# EAGLE design cap meter bubble (EAGLE 6.1)
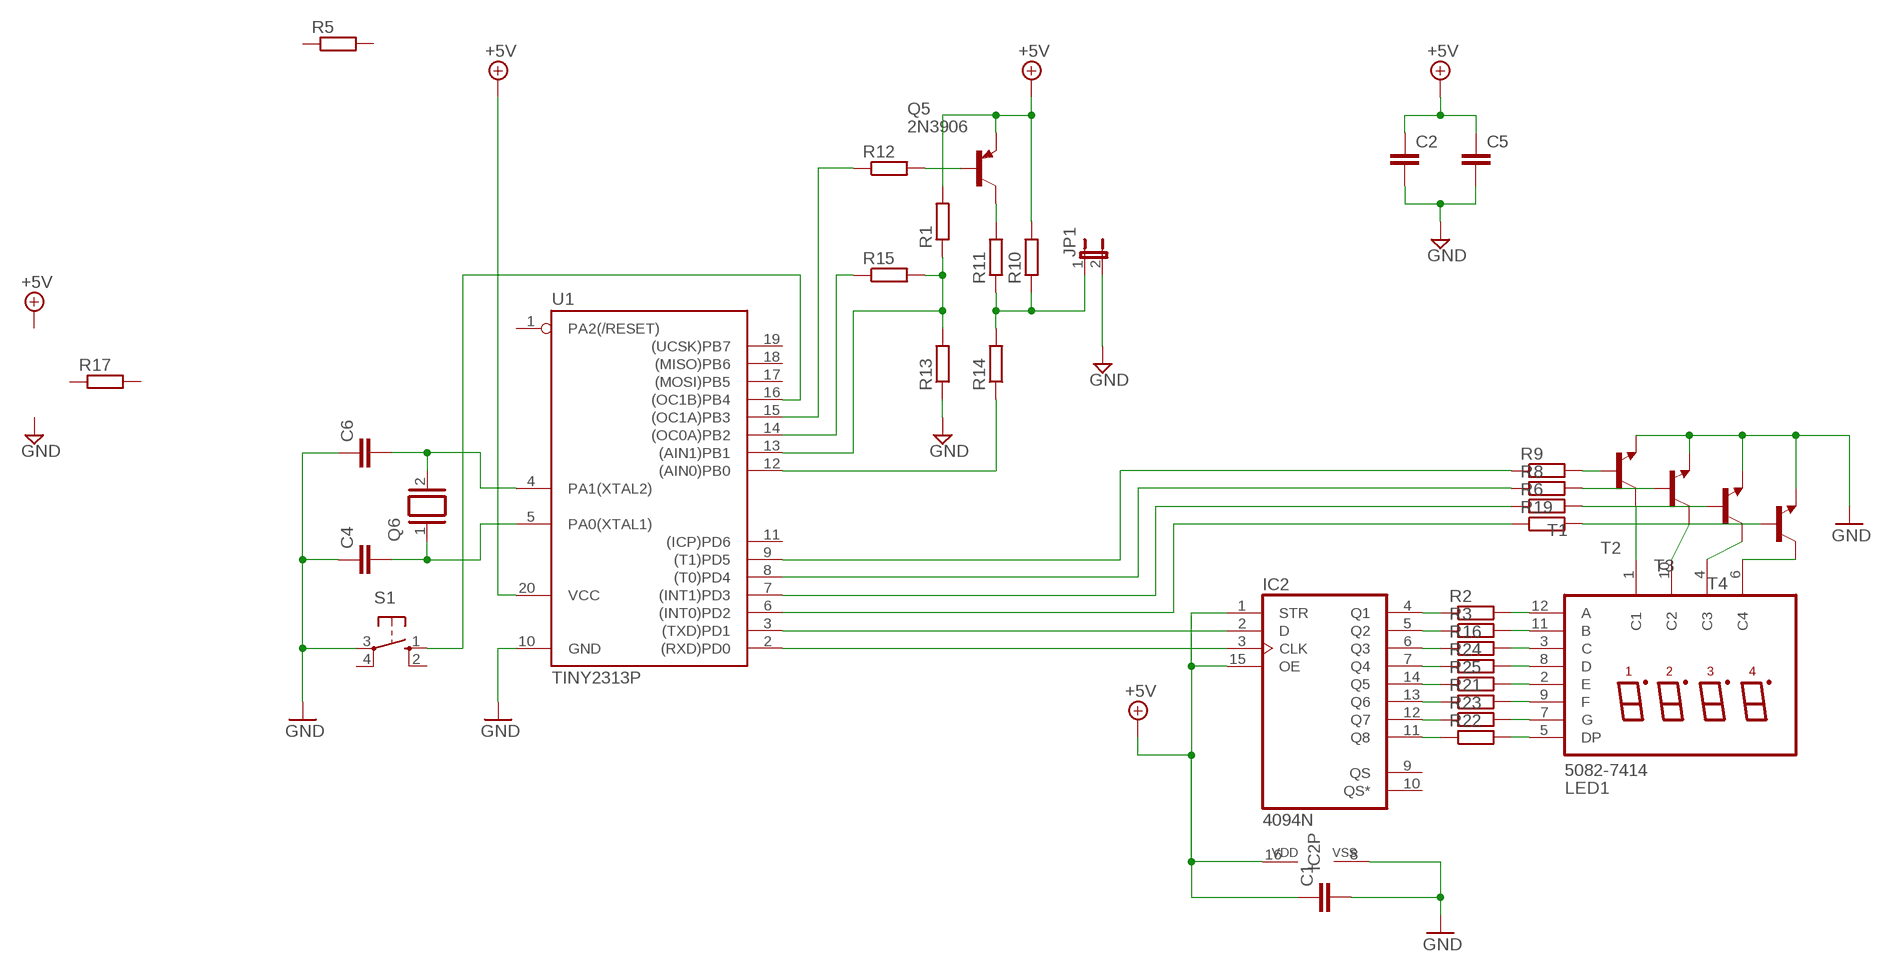
[diagram p0: schematic, sheet 1]

## Parts
C1  C-EU025-025X050  [C025-025X050]
C2  C-EU025-025X050  [C025-025X050]
C4  C-EU025-025X050  [C025-025X050]
C5  C-EU025-025X050  [C025-025X050]
C6  C-EU025-025X050  [C025-025X050]
IC2  4094N  [DIL16]
JP1  JP1E  [JP1]
LED1  5082-7414  [5082-7414]
Q5  2N3906  [TO92]
Q6  XTAL/S  [QS]
R1  R-EU_0204/2V  [0204V]
R2  R-EU_0204/7  [0204/7]
R3  R-EU_0204/7  [0204/7]
R5  R-EU_0204/2V  [0204V]
R6  R-EU_0204/7  [0204/7]
R8  R-EU_0204/7  [0204/7]
R9  R-EU_0204/7  [0204/7]
R10  R-EU_0204/2V  [0204V]
R11  R-EU_0204/2V  [0204V]
R12  R-EU_0204/2V  [0204V]
R13  R-EU_0204/2V  [0204V]
R14  R-EU_0204/2V  [0204V]
R15  R-EU_0204/2V  [0204V]
R16  R-EU_0204/7  [0204/7]
R17  R-EU_0204/2V  [0204V]
R19  R-EU_0204/7  [0204/7]
R21  R-EU_0204/7  [0204/7]
R22  R-EU_0204/7  [0204/7]
R23  R-EU_0204/7  [0204/7]
R24  R-EU_0204/7  [0204/7]
R25  R-EU_0204/7  [0204/7]
S1  10-XX  [B3F-10XX]
T1  -NPN-TO92-EBC  [TO92-EBC]
T2  -NPN-TO92-EBC  [TO92-EBC]
T3  -NPN-TO92-EBC  [TO92-EBC]
T4  -NPN-TO92-EBC  [TO92-EBC]
U1  TINY2313P  [DIL20]

## Nets
+5V: C1.1 C2.1 C5.1 IC2.1(STR) IC2.15(OE) IC2.16(VDD) Q5.3(E) R1.2 R10.2
GND: C1.2 C2.2 C4.1 C5.2 C6.1 IC2.8(VSS) JP1.2 R13.1 S1.3(P) T1.E T2.E T3.E T4.E U1.10(GND)
N$1: LED1.12(A) R2.2
N$3: C4.2 Q6.1
N$4: C6.2 Q6.2
N$5: S1.1(S) U1.16((OC1B)PB4)
N$6: LED1.11(B) R3.2
N$7: Q5.1(C) R11.2
N$8: JP1.1 R10.1 R11.1 R14.2
N$9: R1.1 R13.2 R15.2 U1.13((AIN1)PB1)
N$10: Q5.2(B) R12.2
N$11: R12.1 U1.15((OC1A)PB3)
N$12: R15.1 U1.14((OC0A)PB2)
N$13: R14.1 U1.12((AIN0)PB0)
N$14: IC2.2(D) U1.3((TXD)PD1)
N$15: IC2.3(CLK) U1.2((RXD)PD0)
N$16: LED1.3(C) R16.2
N$17: IC2.4(Q1) R2.1
N$18: IC2.5(Q2) R3.1
N$19: IC2.6(Q3) R16.1
N$20: IC2.7(Q4) R24.1
N$21: IC2.14(Q5) R25.1
N$22: IC2.13(Q6) R21.1
N$23: IC2.12(Q7) R23.1
N$24: IC2.11(Q8) R22.1
N$25: LED1.9(F) R21.2
N$26: LED1.5(DP) R22.2
N$27: LED1.7(G) R23.2
N$28: LED1.8(D) R24.2
N$29: LED1.2(E) R25.2
N$30: LED1.1(C1) T1.C
N$31: LED1.10(C2) T2.C
N$32: LED1.4(C3) T3.C
N$33: LED1.6(C4) T4.C
N$34: R9.2 T1.B
N$35: R8.2 T2.B
N$39: R19.1 U1.6((INT0)PD2)
N$40: R6.1 U1.7((INT1)PD3)
N$41: R8.1 U1.8((T0)PD4)
N$42: R9.1 U1.9((T1)PD5)
N$43: R6.2 T3.B
N$44: R19.2 T4.B
Unconnected: IC2.9(QS) IC2.10(QS*) R5.1 R5.2 R17.1 R17.2 S1.2(S1) S1.4(P1) U1.1(PA2(/RESET)) U1.4(PA1(XTAL2)) U1.5(PA0(XTAL1)) U1.11((ICP)PD6) U1.17((MOSI)PB5) U1.18((MISO)PB6) U1.19((UCSK)PB7)

## Power pins joined to a net without a drawn wire
VCC: U1.20(VCC)

## Library data of the parts
C1 C2 C4-C6 = rcl:C-EU: CAPACITOR, European symbol
IC2 = 40xx:4094: 8-stage SHIFT/STORE REGISTER, tri-state
JP1 = jumper:JP1E: JUMPER
LED1 = hp-displays:5082-7414: 4 digits X 7-segment + DP LED display
Q5 = transistor-pnp:2N3906: PNP Transistor
Q6 = special:XTAL/S: CRYSTAL
R1-R3 R5 R6 R8-R17 R19 R21-R25 = rcl:R-EU_: RESISTOR, European symbol
S1 = switch-omron:10-XX: OMRON SWITCH; MPN: B3F-1000; OC_FARNELL: 176432; OC_NEWARK: 36M3542
T1-T4 = transistor:*-NPN-: NPN Transistror BF959 corrected 2008.03.06
U1 = IC:TINY2313*: Atmel Tiny2313 2K Flash, 128 bytes EEPROM, 128 bytes RAM

## Board
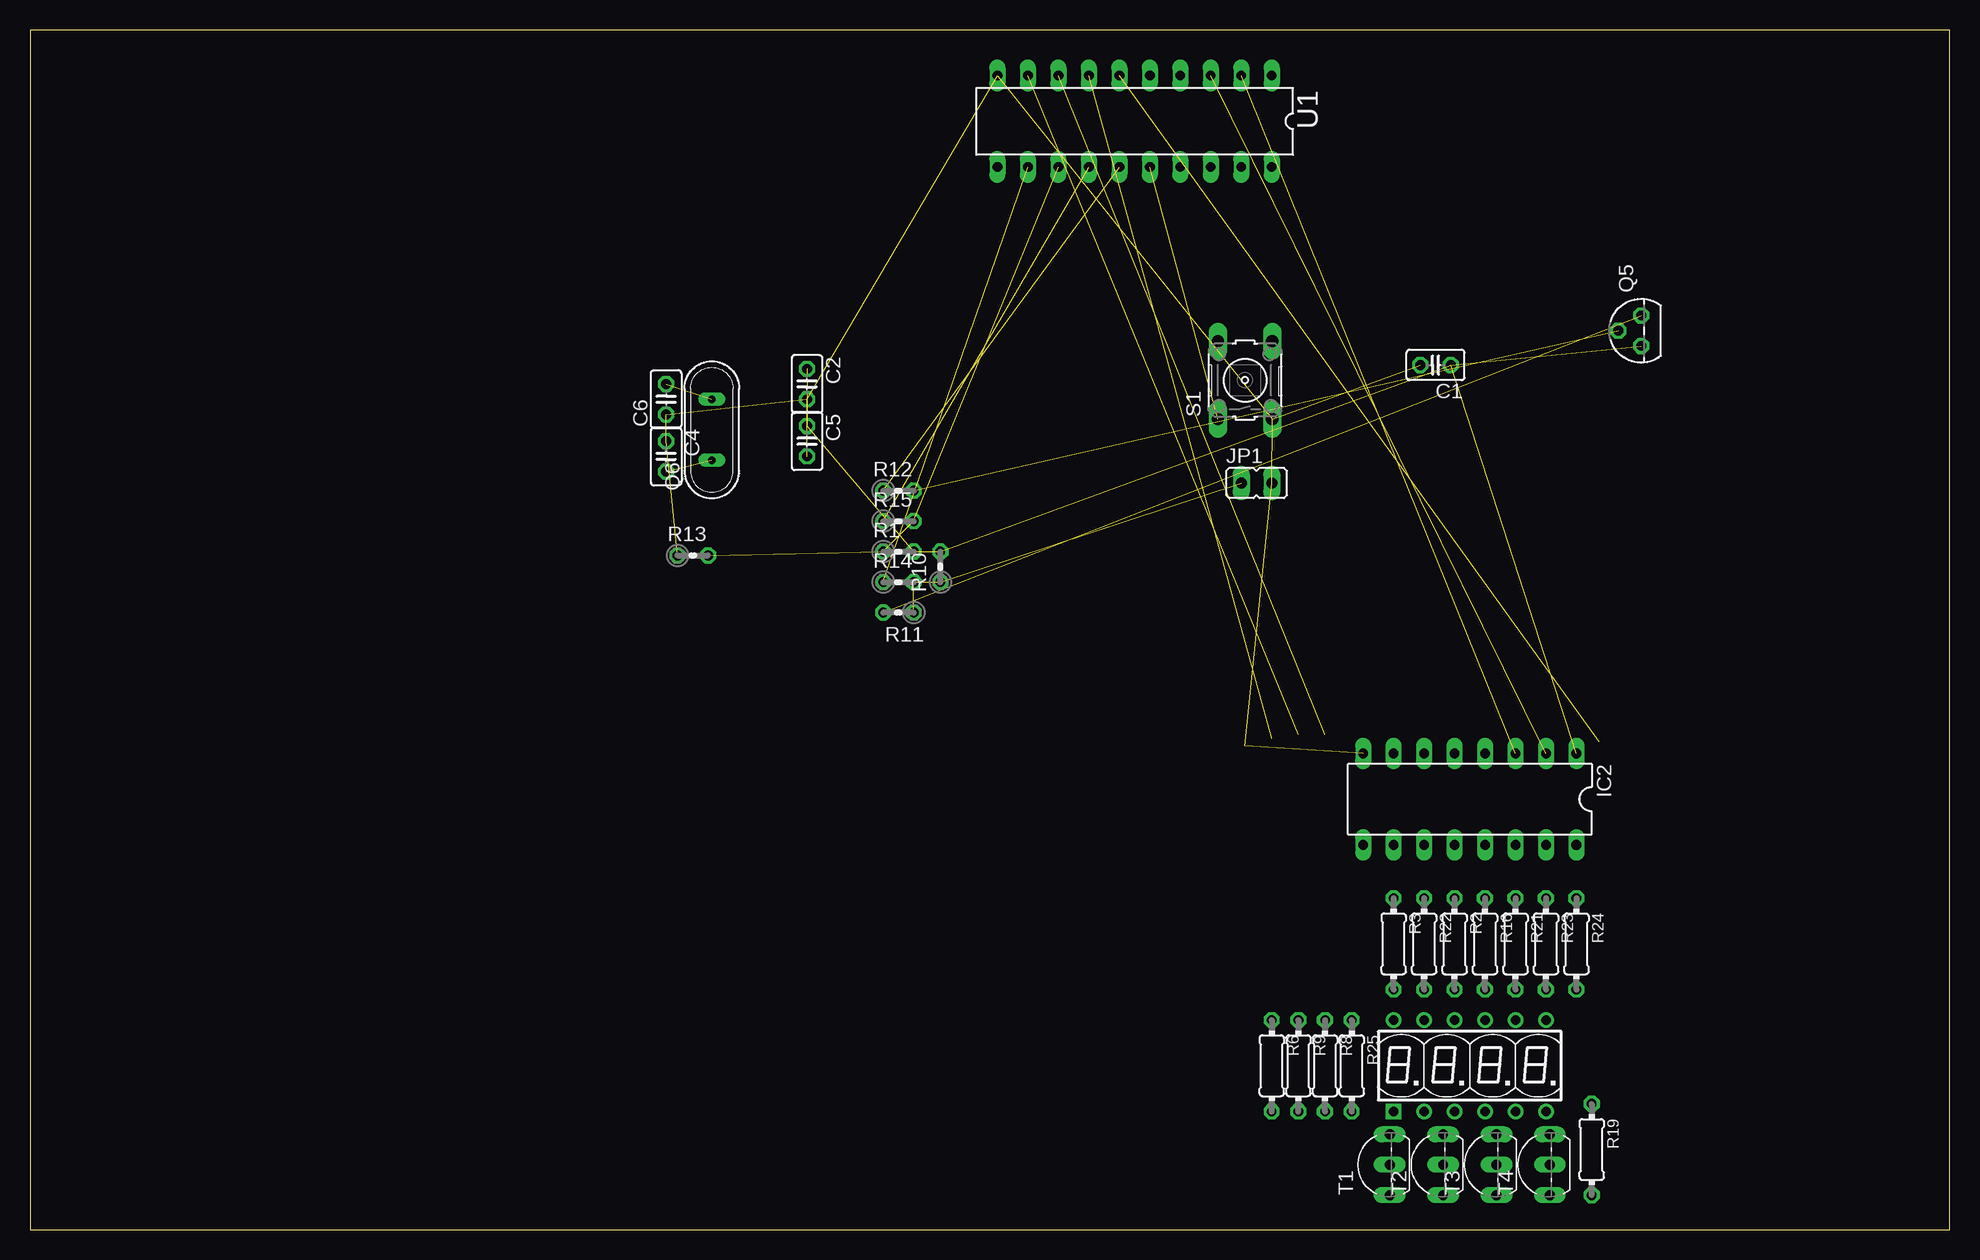
[diagram p1: board, top side]
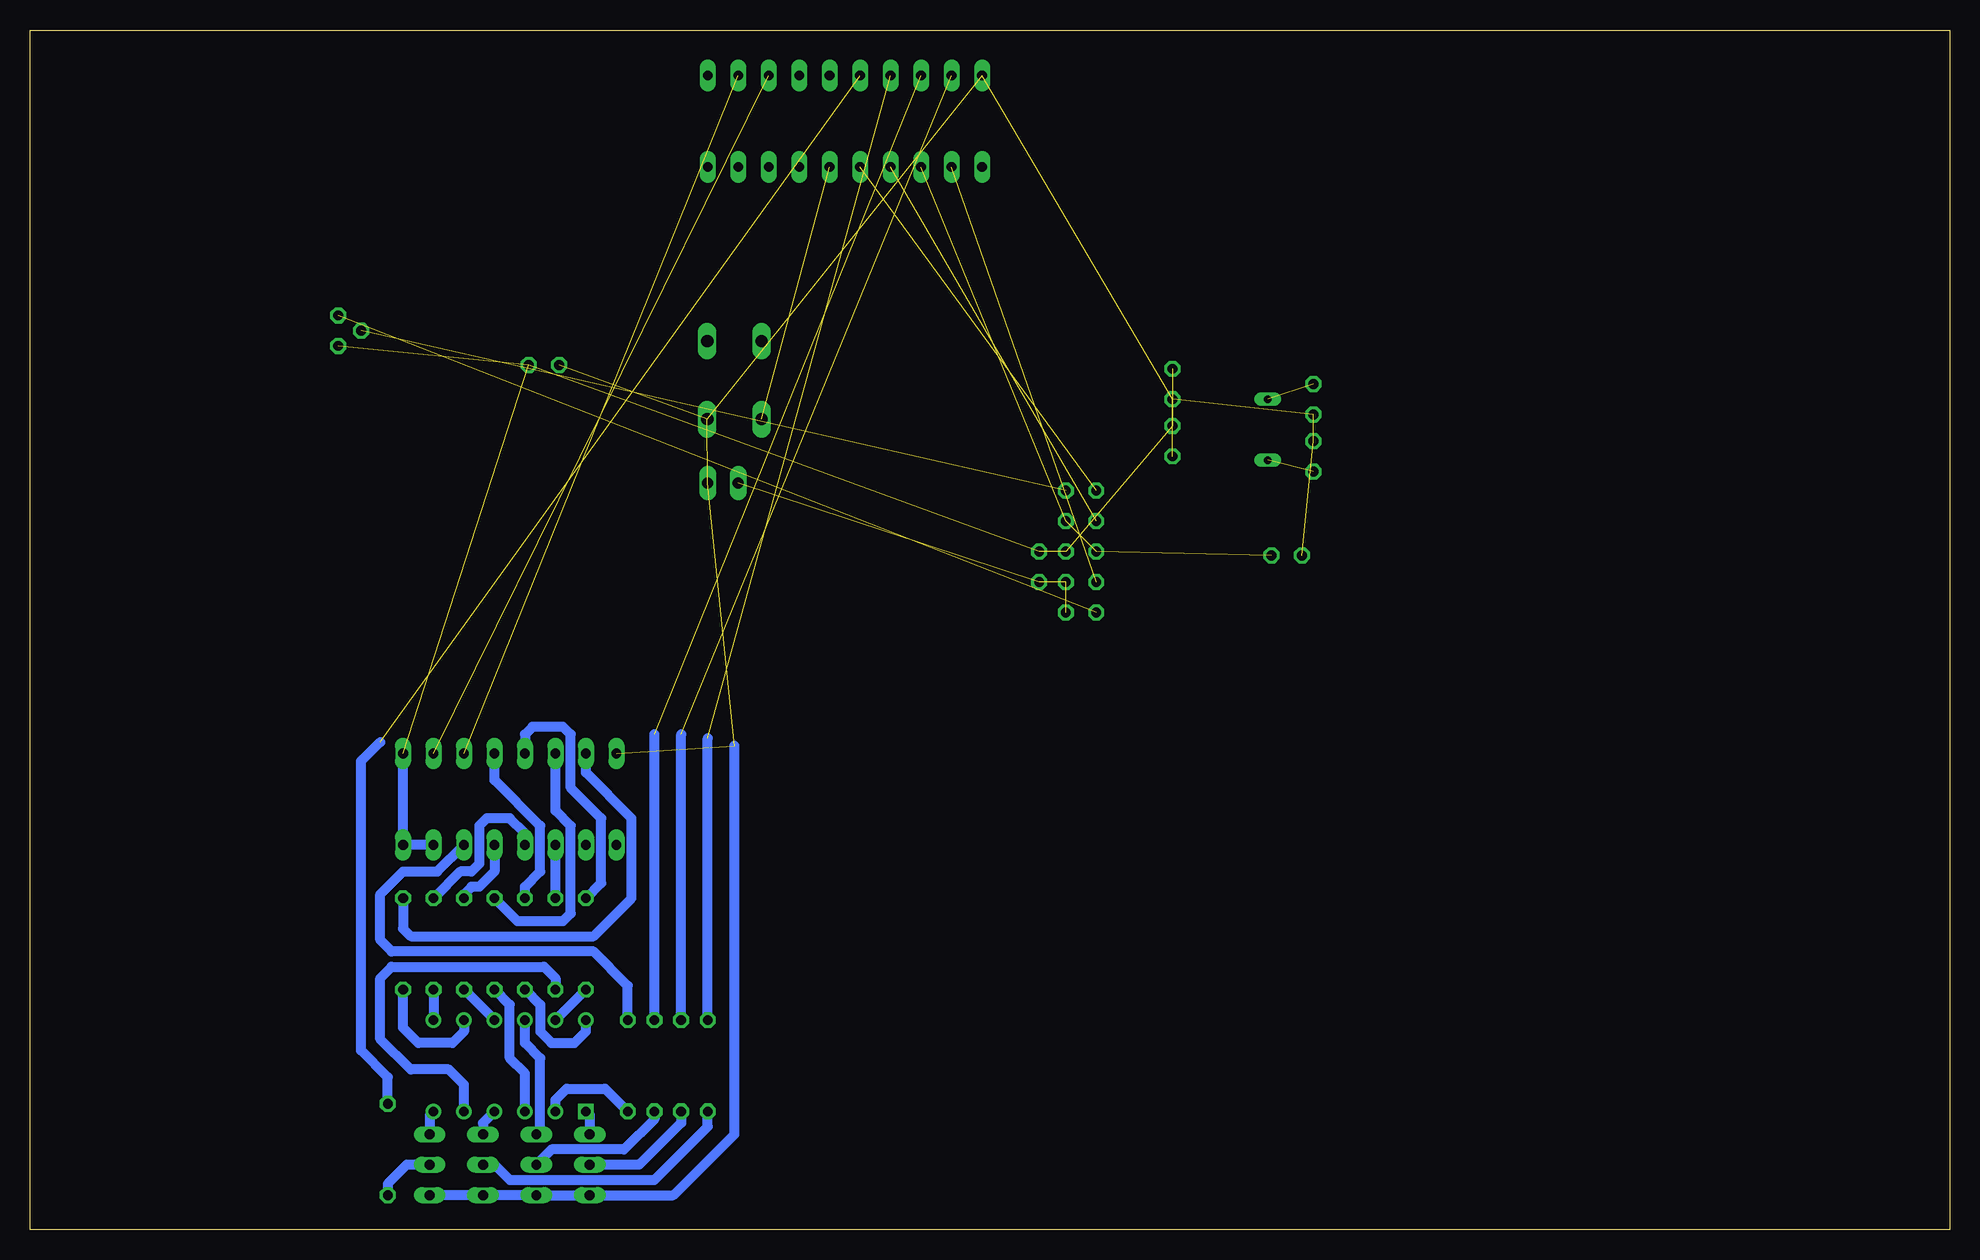
[diagram p2: board, bottom side, seen from below]

Size 160 x 100 mm. Coordinates in mm from the lower left corner, seen from the top.
Outline: 0,0 160,0 160,100 0,100 0,0
Copper layers (1*16): Top 0.035mm / dielectric 1.5mm / Bottom 0.035mm
Design rules: minimum track width 10mil, minimum drill 24mil, track to track 8mil, track to pad 8mil, pad to pad 8mil, via to via 8mil, smd to smd 8mil, copper to edge 40mil, drill to drill 8mil, minimum pad ring 10mil, minimum via ring 8mil, stop-mask expansion 4mil, vias tented up to drill 0mil, thermal gap 10mil

### Footprints (pad centres in the part's own frame; a part is rotated, then mirrored left to right if it is on the bottom)
C025-025X050 = drill 0.813 octagon: 1 -1.27,0; 2 1.27,0
DIL16 = drill 0.813 long: 1 -8.89,-3.81; 2 -6.35,-3.81; 3 -3.81,-3.81; 4 -1.27,-3.81; 5 1.27,-3.81; 6 3.81,-3.81; 7 6.35,-3.81; 8 8.89,-3.81; 9 8.89,3.81; 10 6.35,3.81; 11 3.81,3.81; 12 1.27,3.81; 13 -1.27,3.81; 14 -3.81,3.81; 15 -6.35,3.81; 16 -8.89,3.81
JP1 = drill 0.914 long: 1 0,-1.27; 2 0,1.27
5082-7414 = drill 0.8 square: 1 0,0 | drill 0.8: 2 2.54,0; 3 5.08,0; 4 7.62,0; 5 10.16,0; 6 12.7,0; 7 12.7,7.62; 8 10.16,7.62; 9 7.62,7.62; 10 5.08,7.62; 11 2.54,7.62; 12 0,7.62
TO92 = drill 0.813 octagon: 1 1.27,0; 2 0,1.905; 3 -1.27,0
QS = drill 0.61 long: 1 -2.54,0; 2 2.54,0
0204V = drill 0.813 octagon: 1 -1.27,0; 2 1.27,0
0204/7 = drill 0.813 octagon: 1 -3.81,0; 2 3.81,0
B3F-10XX = drill 1.016 long: 1 -3.251,2.261; 2 3.251,2.261; 3 -3.251,-2.261; 4 3.251,-2.261
TO92-EBC = drill 0.813 long: B 0,-1.27; C 2.54,-1.27; E -2.54,-1.27
DIL20 = drill 0.813 long: 1 -11.43,-3.81; 2 -8.89,-3.81; 3 -6.35,-3.81; 4 -3.81,-3.81; 5 -1.27,-3.81; 6 1.27,-3.81; 7 3.81,-3.81; 8 6.35,-3.81; 9 8.89,-3.81; 10 11.43,-3.81; 11 11.43,3.81; 12 8.89,3.81; 13 6.35,3.81; 14 3.81,3.81; 15 1.27,3.81; 16 -1.27,3.81; 17 -3.81,3.81; 18 -6.35,3.81; 19 -8.89,3.81; 20 -11.43,3.81

### Placement (x,y rotation side)
C1  117.16,72.07 180 top
C2  64.77,70.48 270 top
C4  53.02,64.45 270 top
C5  64.77,65.72 270 top
C6  53.02,69.22 90 top
IC2  120.02,35.88 180 top
JP1  102.23,62.23 270 top
LED1  113.67,9.84 0 top
Q5  134.3,74.93 90 top
Q6  56.83,66.67 90 top
R1  72.39,56.52 0 top
R2  118.75,23.81 270 top
R3  113.67,23.81 270 top
R5  -36.83,25.4 0 top  (outside the outline)
R6  103.5,13.65 270 top
R8  107.95,13.65 270 top
R9  105.73,13.65 270 top
R10  75.88,55.24 90 top
R11  72.39,51.44 180 top
R12  72.39,61.59 0 top
R13  55.24,56.2 0 top
R14  72.39,53.98 0 top
R15  72.39,59.05 0 top
R16  121.28,23.81 270 top
R17  -15.24,37.15 0 top  (outside the outline)
R19  130.18,6.67 270 top
R21  123.83,23.81 270 top
R22  116.2,23.81 270 top
R23  126.36,23.81 270 top
R24  128.91,23.81 270 top
R25  110.17,13.65 270 top
S1  101.28,70.8 90 top
T1  112.08,5.4 90 top
T2  116.52,5.4 90 top
T3  120.97,5.4 90 top
T4  125.41,5.4 90 top
U1  92.08,92.39 180 top

### Tracks (layer width: path | path; a pad name or v marks a point on that pad's centre or on a via)
+5V  (6 unrouted)
  Bottom 0.813: IC2.15 IC2.16 IC2.1
GND  (10 unrouted)
  Bottom 0.813: T4.E T3.E T2.E T1.E 106.36,2.86 101.28,7.94 101.28,40.32
N$1
  Bottom 0.813: R2.2 117.47,18.73 117.47,16.51 116.52,15.56 114.62,15.56 113.67,16.51 LED1.12
N$3  (1 unrouted)
N$4  (1 unrouted)
N$5  (1 unrouted)
N$6
  Bottom 0.813: R3.2 LED1.11
N$7  (1 unrouted)
N$8  (3 unrouted)
N$9  (3 unrouted)
N$10  (1 unrouted)
N$11  (1 unrouted)
N$12  (1 unrouted)
N$13  (1 unrouted)
N$14  (1 unrouted)
N$15  (1 unrouted)
N$16
  Bottom 0.813: LED1.3 118.75,13.02 120.02,14.29 120.02,18.73 R16.2
N$17
  Bottom 0.813: R2.1 118.75,28.57 117.47,29.84 117.47,33.66 121.28,37.47 IC2.4
N$18
  Bottom 0.813: R3.1 112.39,28.89 112.39,34.29 114.94,36.83 114.94,41.27 115.57,41.91 118.11,41.91 118.75,41.27 IC2.5
N$19
  Bottom 0.813: R16.1 119.38,25.72 115.57,25.72 114.94,26.35 114.94,33.66 116.2,34.92 IC2.6
N$20
  Bottom 0.813: R24.1 128.91,25.08 128.27,24.45 113.03,24.45 109.86,27.62 109.86,34.29 113.67,38.1 IC2.7
N$21
  Bottom 0.813: R25.1 110.17,20.32 113.03,23.18 129.86,23.18 130.81,24.13 130.81,27.94 128.91,29.84 126.05,29.84 IC2.14
N$22
  Bottom 0.813: IC2.13 121.28,29.84 122.56,28.57 123.19,28.57 123.83,27.94 R21.1
N$23
  Bottom 0.813: IC2.12 118.75,33.02 120.02,34.29 121.92,34.29 122.56,33.66 122.56,30.48 123.19,29.84 124.14,29.84 R23.1
N$24
  Bottom 0.813: R22.1 IC2.11
N$25
  Bottom 0.813: R21.2 LED1.9
N$26
  Bottom 0.813: R22.2 116.2,20.95 117.16,21.91 129.86,21.91 130.81,20.95 130.81,15.88 128.27,13.34 125.09,13.34 123.83,12.06 LED1.5
N$27
  Bottom 0.813: R23.2 LED1.7
N$28
  Bottom 0.813: LED1.8 123.83,16.51 124.78,15.56 127.64,15.56 128.91,16.83 R24.2
N$29
  Bottom 0.813: LED1.2 116.2,10.79 115.25,11.75 112.08,11.75 R25.2
N$30
  Bottom 0.813: LED1.1 113.35,9.53 T1.C
N$31
  Bottom 0.813: T2.C 117.47,7.94 117.47,14.29 118.75,15.56 LED1.10
N$32
  Bottom 0.813: LED1.4 122.24,8.89 T3.C
N$33
  Bottom 0.813: LED1.6 126.68,9.53 T4.C
N$34
  Bottom 0.813: R9.2 105.73,8.89 109.22,5.4 T1.B
N$35
  Bottom 0.813: R8.2 107.95,9.21 110.49,6.67 116.52,6.67 T2.B
N$39  (1 unrouted)
  Bottom 0.813: R19.1 130.18,12.7 132.4,14.92 132.4,39.05 130.81,40.64
N$40  (1 unrouted)
  Bottom 0.813: R6.1 103.5,40.96
N$41  (1 unrouted)
  Bottom 0.813: R8.1 107.95,41.27
N$42  (1 unrouted)
  Bottom 0.813: R9.1 105.73,41.27
N$43
  Bottom 0.813: T3.B 121.28,5.4 120.02,4.13 107.95,4.13 103.5,8.57 R6.2
N$44
  Bottom 0.813: T4.B 128.59,5.4 130.18,3.81 R19.2